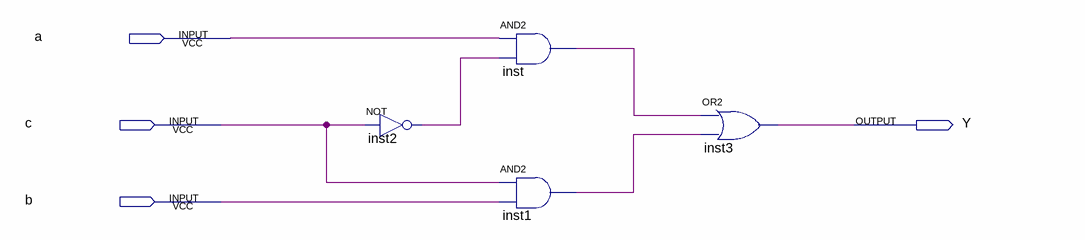
[diagram p0: schematic sheet]
// Quartus schematic mux_21.bdf as structural Verilog: 4 symbols, 4 pins
module mux_21 (
  input  a,
  input  c,
  input  b,
  output Y
);

  wire inst1_out, inst2_out, inst_out;

  not inst2 (inst2_out, c);
  and inst (inst_out, a, inst2_out);
  and inst1 (inst1_out, c, b);
  or inst3 (Y, inst_out, inst1_out);
endmodule
